# Altium schematic sheet DSP_Interface.SchDoc
size A4; SheetNumber: 9; SheetTotal: 15
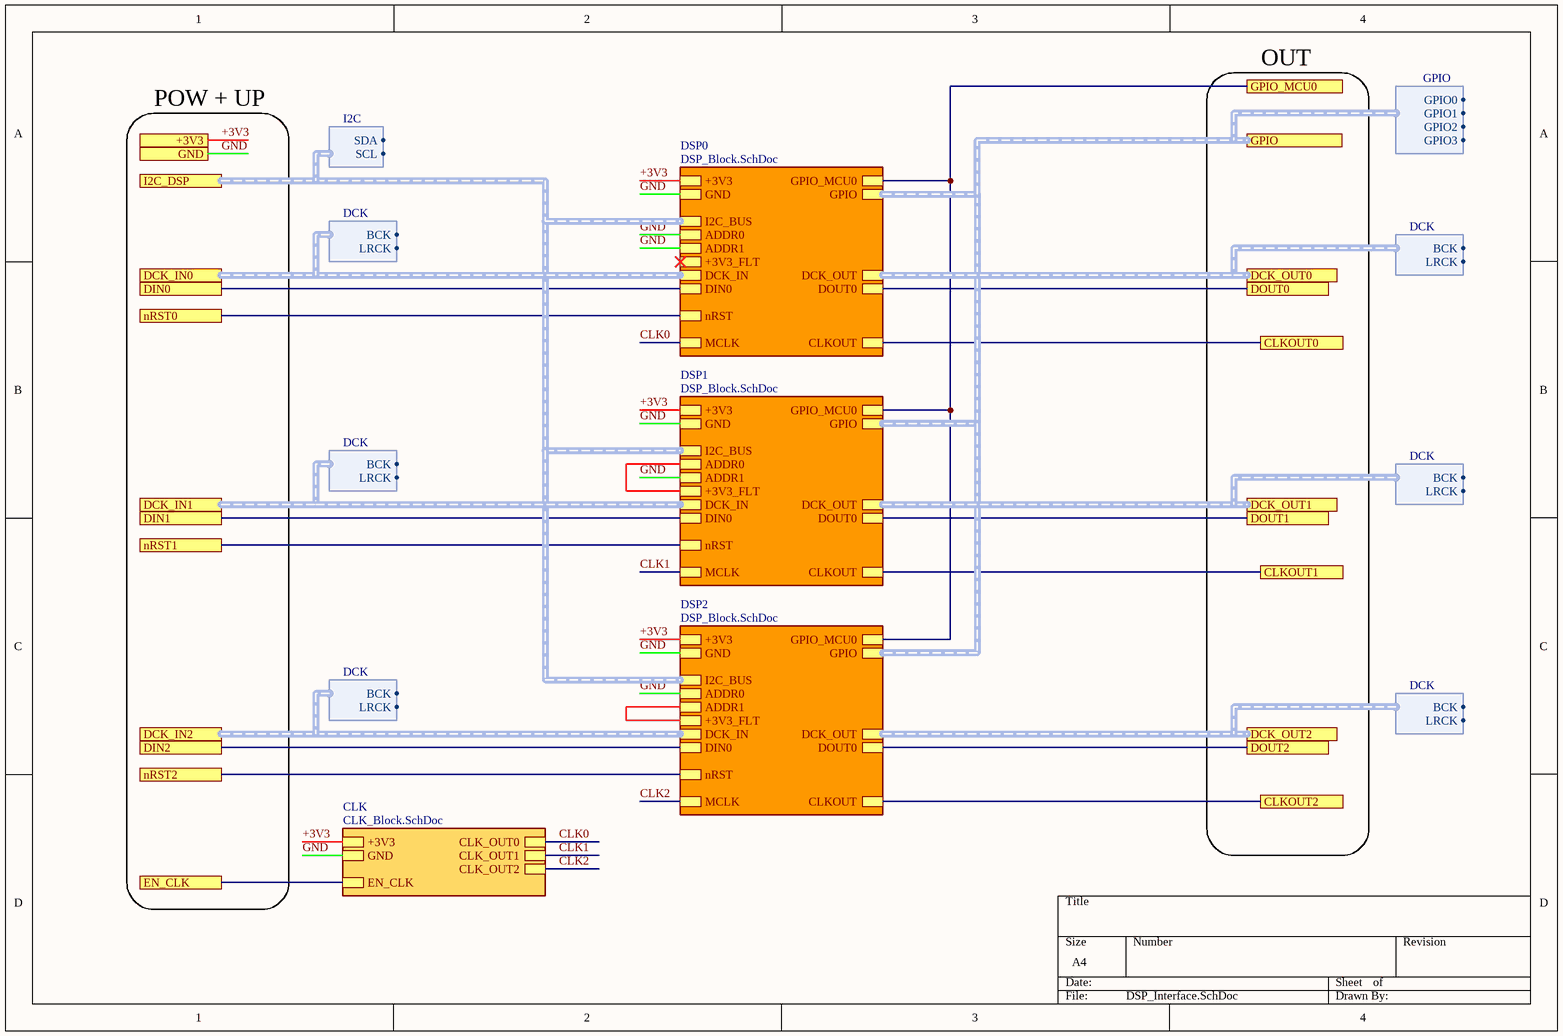
[diagram p0: DSP_Interface.SchDoc]

## Sub-sheets
CLK = CLK_Block.SchDoc: +3V3, GND, EN_CLK, CLK_OUT0, CLK_OUT1, CLK_OUT2
DSP0 = DSP_Block.SchDoc: +3V3, GND, CLKOUT, nRST, ADDR0, ADDR1, I2C_BUS (harness I2C), DCK_IN (harness DCK), DIN0, DCK_OUT (harness DCK), DOUT0, GPIO (harness GPIO), MCLK, GPIO_MCU0, +3V3_FLT
DSP1 = DSP_Block.SchDoc: +3V3, GND, CLKOUT, nRST, ADDR0, ADDR1, I2C_BUS (harness I2C), DCK_IN (harness DCK), DIN0, DCK_OUT (harness DCK), DOUT0, GPIO (harness GPIO), MCLK, GPIO_MCU0, +3V3_FLT
DSP2 = DSP_Block.SchDoc: +3V3, GND, CLKOUT, nRST, ADDR0, ADDR1, I2C_BUS (harness I2C), DCK_IN (harness DCK), DIN0, DCK_OUT (harness DCK), DOUT0, GPIO (harness GPIO), MCLK, GPIO_MCU0, +3V3_FLT

## Ports
+3V3, CLKOUT0, CLKOUT1, CLKOUT2, DCK_IN0 (harness DCK), DCK_IN1 (harness DCK), DCK_IN2 (harness DCK), DCK_OUT0 (harness DCK), DCK_OUT1 (harness DCK), DCK_OUT2 (harness DCK), DIN0, DIN1, DIN2, DOUT0, DOUT1, DOUT2, EN_CLK, GND, GPIO (harness GPIO), GPIO_MCU0, I2C_DSP (harness I2C), nRST0, nRST1, nRST2

## Harnesses
DCK: BCK, LRCK
GPIO: GPIO0, GPIO1, GPIO2, GPIO3
I2C: SCL, SDA

## Nets
+3V3: port +3V3, sheet DSP0/+3V3, sheet DSP1/+3V3, sheet DSP2/+3V3, sheet CLK/+3V3
CLK0: sheet DSP0/MCLK, sheet CLK/CLK_OUT0
CLK1: sheet DSP1/MCLK, sheet CLK/CLK_OUT1
CLK2: sheet DSP2/MCLK, sheet CLK/CLK_OUT2
CLKOUT0: port CLKOUT0, sheet DSP0/CLKOUT
CLKOUT1: port CLKOUT1, sheet DSP1/CLKOUT
CLKOUT2: port CLKOUT2, sheet DSP2/CLKOUT
DIN0: port DIN0, sheet DSP0/DIN0
DIN1: port DIN1, sheet DSP1/DIN0
DIN2: port DIN2, sheet DSP2/DIN0
DOUT0: port DOUT0, sheet DSP0/DOUT0
DOUT1: port DOUT1, sheet DSP1/DOUT0
DOUT2: port DOUT2, sheet DSP2/DOUT0
EN_CLK: port EN_CLK, sheet CLK/EN_CLK
GND: port GND, sheet DSP0/GND, sheet DSP0/ADDR0, sheet DSP0/ADDR1, sheet DSP1/GND, sheet DSP1/ADDR1, sheet DSP2/GND, sheet DSP2/ADDR0, sheet CLK/GND
GPIO_MCU0: port GPIO_MCU0, sheet DSP0/GPIO_MCU0, sheet DSP1/GPIO_MCU0, sheet DSP2/GPIO_MCU0
nRST0: port nRST0, sheet DSP0/nRST
nRST1: port nRST1, sheet DSP1/nRST
nRST2: port nRST2, sheet DSP2/nRST
(unnamed): sheet DSP1/ADDR0, sheet DSP1/+3V3_FLT
(unnamed): sheet DSP2/ADDR1, sheet DSP2/+3V3_FLT

## Buses and harness runs
harness port DCK_IN0 = sheet DSP0/DCK_IN
harness port DCK_IN1 = sheet DSP1/DCK_IN
harness port DCK_IN2 = sheet DSP2/DCK_IN
harness port DCK_OUT0 = sheet DSP0/DCK_OUT
harness port DCK_OUT1 = sheet DSP1/DCK_OUT
harness port DCK_OUT2 = sheet DSP2/DCK_OUT
harness port GPIO = sheet DSP0/GPIO = sheet DSP1/GPIO = sheet DSP2/GPIO
harness port I2C_DSP = sheet DSP0/I2C_BUS = sheet DSP1/I2C_BUS = sheet DSP2/I2C_BUS

## Notes on the sheet
- POW + UP
- OUT